# EasyEDA Pro project sensor_design.eprj

# Schematic Schematic1
Board Name: Board1; Create Date: 2025-11-29; Page Name: 1; Project Name: sensor_design; Schematic Name: Schematic1; Update Date: 2025-12-01; Company: 嘉立创EDA; Page Size: A4; Version: V1.0
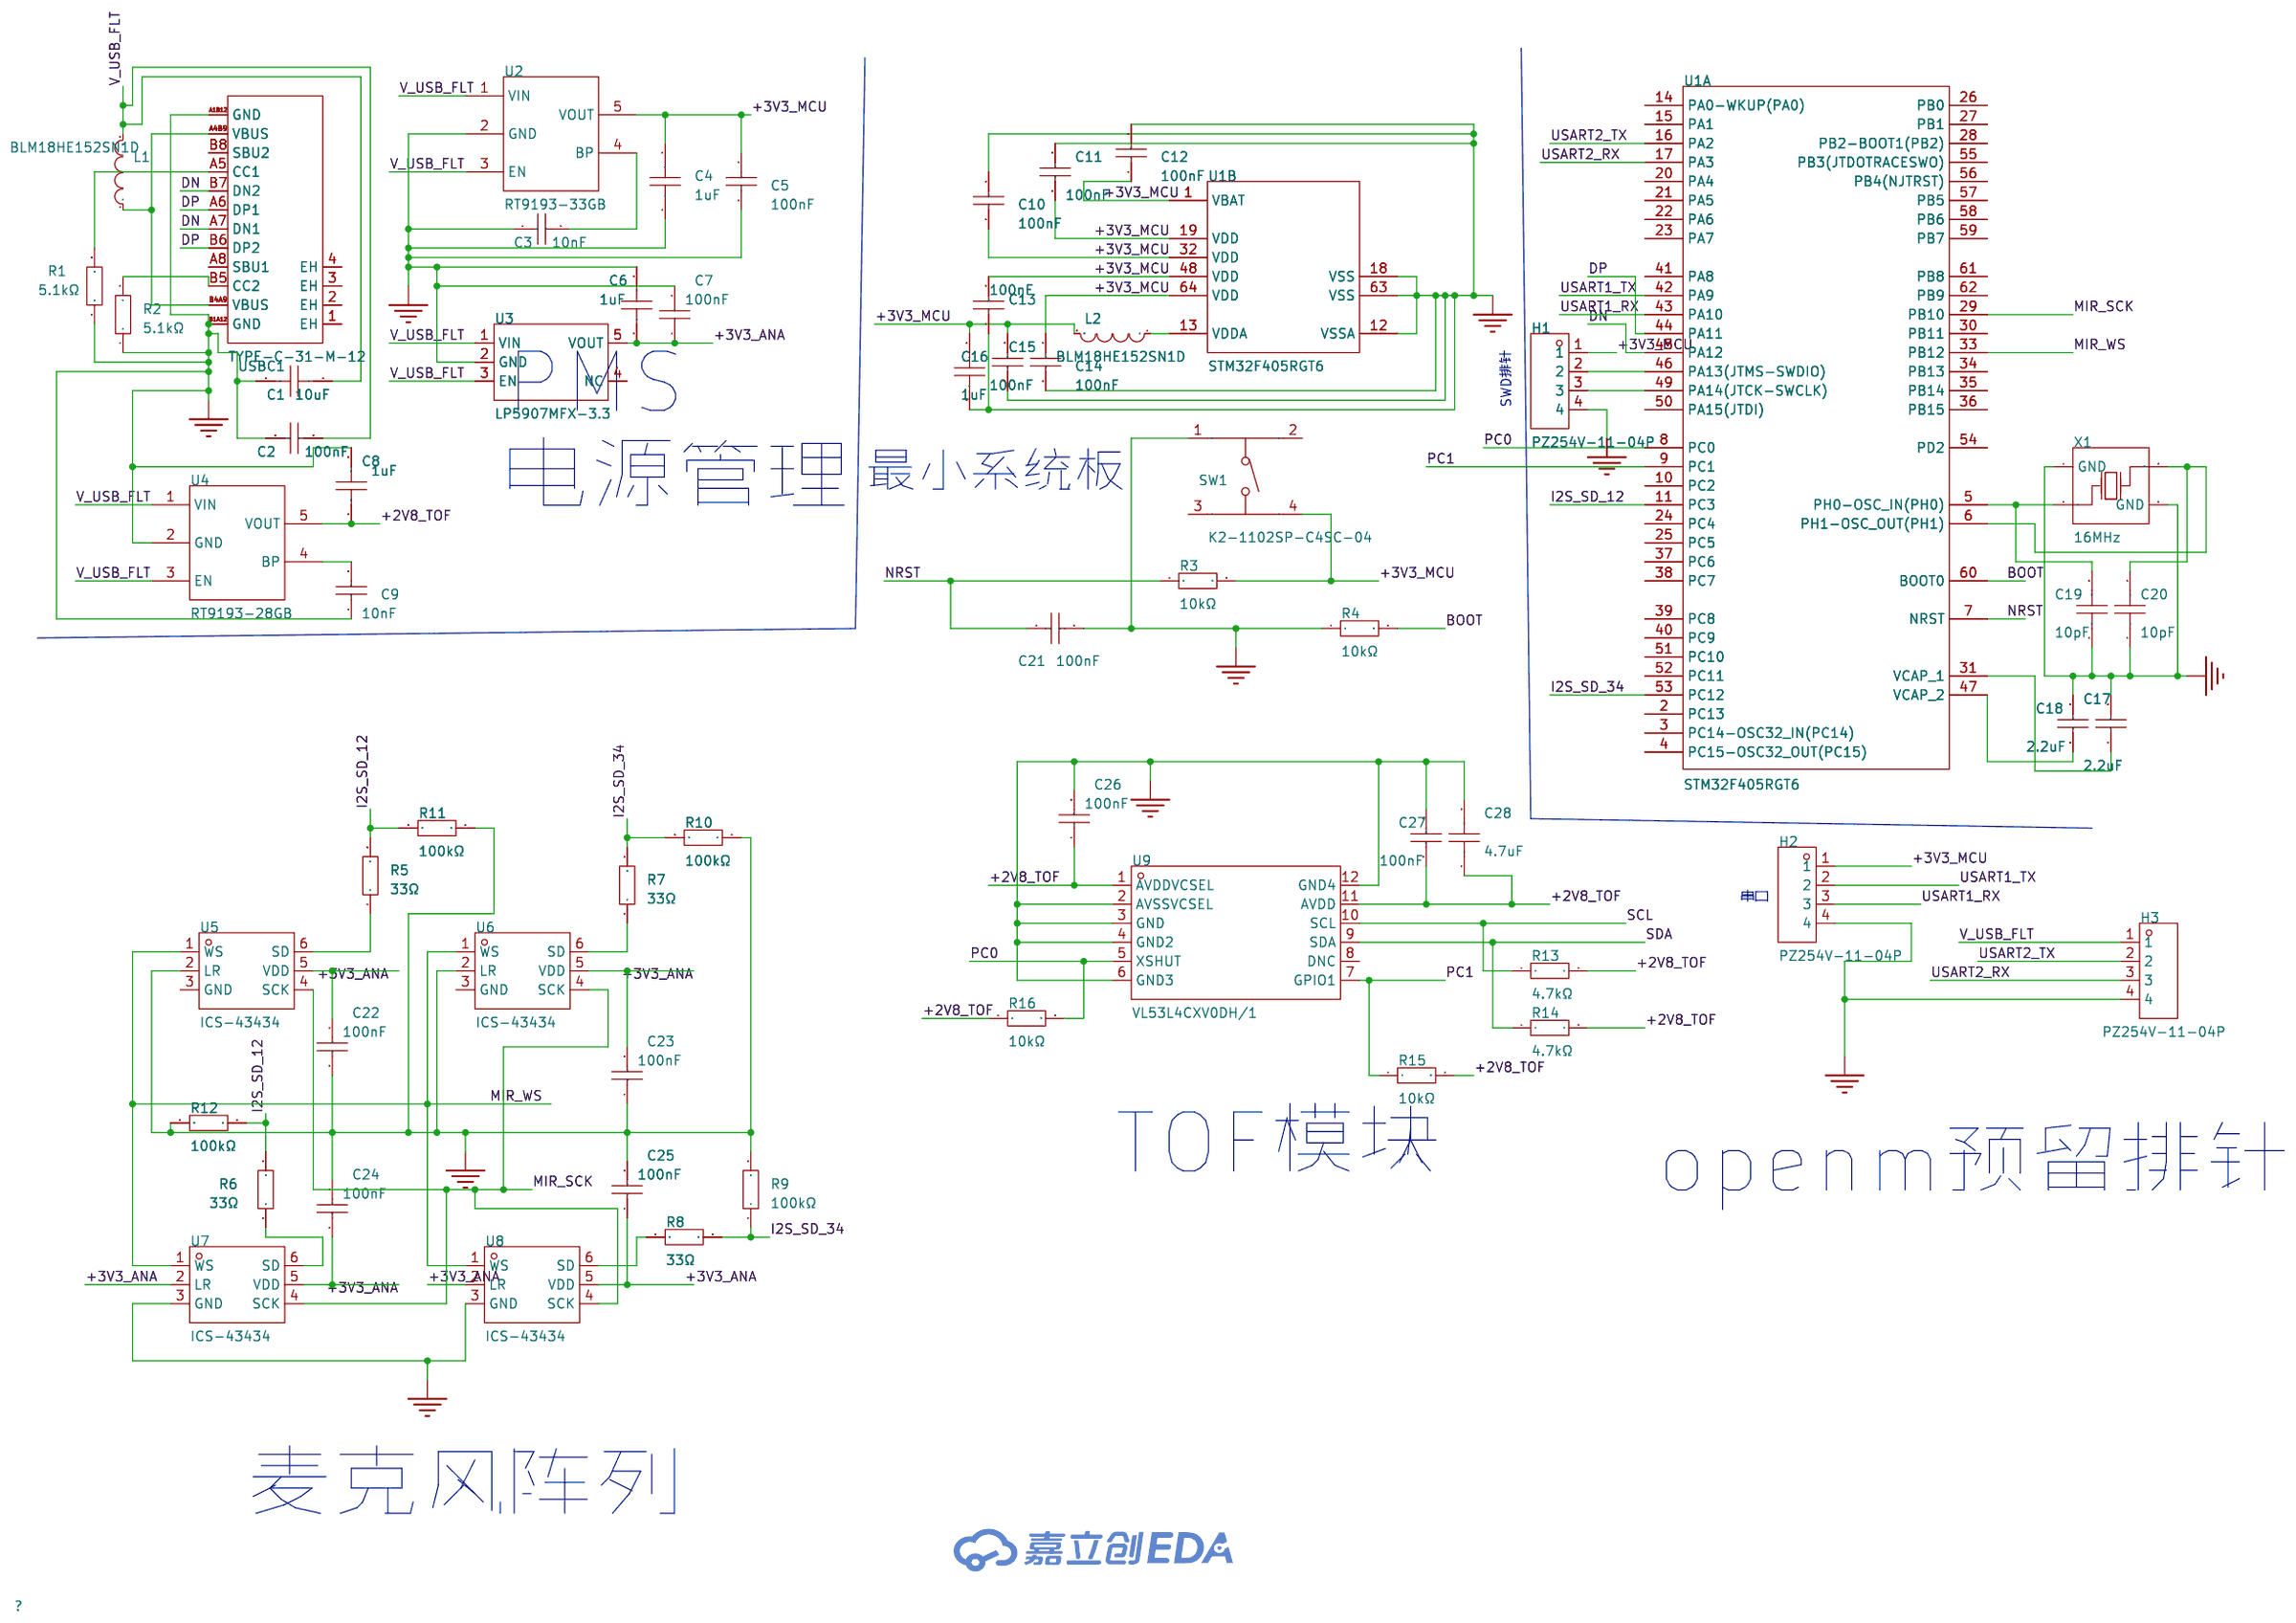
[diagram p0: schematic sheet]

## Parts
C1  10uF  [C0805]
C2  100nF  [C0603]
C3  10nF  [C0603]
C4  1uF  [C0603]
C5  100nF  [C0603]
C6  1uF  [C0603]
C7  100nF  [C0603]
C8  1uF  [C0603]
C9  10nF  [C0603]
C10  100nF  [C0603]
C11  100nF  [C0603]
C12  100nF  [C0603]
C13  100nF  [C0603]
C14  100nF  [C0603]
C15  100nF  [C0603]
C16  1uF  [C0603]
C17  2.2uF  [C0603]
C18  2.2uF  [C0603]
C19  10pF  [C0402]
C20  10pF  [C0402]
C21  100nF  [C0603]
C22  100nF  [C0603]
C23  100nF  [C0603]
C24  100nF  [C0603]
C25  100nF  [C0603]
C26  100nF  [C0402]
C27  100nF  [C0402]
C28  4.7uF  [C0603]
H1  PZ254V-11-04P  [HDR-TH_4P-P2.54-V-M]
H2  PZ254V-11-04P  [HDR-TH_4P-P2.54-V-M]
H3  PZ254V-11-04P  [HDR-TH_4P-P2.54-V-M]
L1  BLM18HE152SN1D  [L0603]
L2  BLM18HE152SN1D  [L0603]
R1  5.1kΩ  [R0603]
R2  5.1kΩ  [R0603]
R3  10kΩ  [R0603]
R4  10kΩ  [R0603]
R5  33Ω  [R0603]
R6  33Ω  [R0603]
R7  33Ω  [R0603]
R8  33Ω  [R0603]
R9  100kΩ  [R0603]
R10  100kΩ  [R0603]
R11  100kΩ  [R0603]
R12  100kΩ  [R0603]
R13  4.7kΩ  [R0603]
R14  4.7kΩ  [R0603]
R15  10kΩ  [R0603]
R16  10kΩ  [R0603]
SW1  K2-1102SP-C4SC-04  [KEY-SMD_4P-L6.0-W6.0-P4.50-LS9.5-BL]
U1  STM32F405RGT6  [LQFP-64_L10.0-W10.0-P0.50-LS12.0-BL]  (sections 1,2)
U2  RT9193-33GB  [SOT-23-5_L3.0-W1.7-P0.95-LS2.8-BL]
U3  LP5907MFX-3.3  [SOT-23-5_L3.0-W1.7-P0.95-LS2.8-BR]
U4  RT9193-28GB  [SOT-23-5_L3.0-W1.7-P0.95-LS2.8-BR]
U5  ICS-43434  [MIC-SMD_6P-L3.5-W2.7-P0.90-BL]
U6  ICS-43434  [MIC-SMD_6P-L3.5-W2.7-P0.90-BL]
U7  ICS-43434  [MIC-SMD_6P-L3.5-W2.7-P0.90-BL]
U8  ICS-43434  [MIC-SMD_6P-L3.5-W2.7-P0.90-BL]
U9  VL53L4CXV0DH/1  [OPTO-SMD_VL53L1CXV0FY-1]
USBC1  TYPE-C-31-M-12  [USB-C_SMD-TYPE-C-31-M-12_1]
X1  16MHz  [CRYSTAL-SMD_4P-L3.2-W2.5-BL]

## Library data of the parts
C1 = GRM21BR61C106KE15L: LCSC Part Name: 10uF ±10% 16V; Supplier Part: C77075; Manufacturer: muRata(村田); Supplier Footprint: 0805; JLCPCB Part Class: 扩展库; Datasheet: https://atta.szlcsc.com/upload/public/pdf/source/20200305/C490387_23319AE8C154DEB24C505E6C82A8106A.pdf; Supplier: LCSC; Tolerance: ±10%; Voltage Rated: 16V; Temperature Coefficient: X5R
C2 C3 C5 C7 C9-C15 C21-C25 = CL10B104KA8NNNC: LCSC Part Name: 100nF ±10% 25V; Supplier Part: C1590; Manufacturer: SAMSUNG(三星); Supplier Footprint: 0603; JLCPCB Part Class: 扩展库; Datasheet: https://item.szlcsc.com/datasheet/CL10B104KA8NNNC/1942.html; Supplier: LCSC; Tolerance: ±10%; Voltage Rating: 25V; Temperature Coefficient: X7R
C4 C6 C8 C16 = GRM188R71C105KE15D: LCSC Part Name: 1uF ±10% 16V; Supplier Part: C77049; Manufacturer: muRata(村田); Supplier Footprint: 0603; JLCPCB Part Class: 扩展库; Datasheet: https://item.szlcsc.com/datasheet/GRM188R71C105KE15D/78176.html; Supplier: LCSC; Tolerance: ±10%; Voltage Rating: 16V; Temperature Coefficient: X7R
C17 C18 = CL10A225KP8NNNC: LCSC Part Name: 2.2uF ±10% 10V; Supplier Part: C1607; Manufacturer: SAMSUNG(三星); Supplier Footprint: 0603; JLCPCB Part Class: 扩展库; Datasheet: https://item.szlcsc.com/datasheet/CL10A225KP8NNNC/1959.html; Supplier: LCSC; Tolerance: ±10%; Voltage Rating: 10V; Temperature Coefficient: X5R
C19 C20 = GJM1555C1H100FB01D: LCSC Part Name: 10pF ±1% 50V; Supplier Part: C782046; Manufacturer: muRata(村田); Supplier Footprint: 0402; JLCPCB Part Class: 扩展库; Datasheet: https://item.szlcsc.com/datasheet/GJM1555C1H100FB01D/835268.html; Supplier: LCSC; Tolerance: ±1%; Voltage Rating: 50V; Temperature Coefficient: C0G
C26 C27 = CGA0402X7R104K250GT: LCSC Part Name: 100nF ±10% 25V; Supplier Part: C6119778; Manufacturer: HRE(芯声); Supplier Footprint: 0402; JLCPCB Part Class: Extended Part; Supplier: LCSC; Tolerance: ±10%; Voltage Rating: 25V; Temperature Coefficient: X7R
C28 = GRM188Z71C475KE21D: LCSC Part Name: 4.7uF ±10% 16V; Supplier Part: C389010; Manufacturer: muRata(村田); Supplier Footprint: 0603; JLCPCB Part Class: 扩展库; Datasheet: https://item.szlcsc.com/datasheet/GRM188Z71C475KE21D/364359.html; Supplier: LCSC; Tolerance: ±10%; Voltage Rating: 16V; Temperature Coefficient: X7R
H1-H3 = PZ254V-11-04P: LCSC Part Name: 1x4P 间距:2.54mm 方针 直插; Supplier Part: C2691448; Manufacturer: XFCN(兴飞); Supplier Footprint: 插件,P=2.54mm; JLCPCB Part Class: 扩展库; Datasheet: https://item.szlcsc.com/datasheet/PZ254V-11-04P/2801085.html; Supplier: LCSC; Pin Structure: 1x4P; Pitch: 2.54mm; Circluar Pins/Square Pins: 方针; Mounting Type: 直插; Number of Rows: 单排; Number of Pins: 4P; Current Rating: 3A; Voltage Rating (Max): 250V; Length of Mating Pin: 6mm; Insulation Height: 2.5mm; Length of End Connection Pin: 3mm; Operating Temperature: -40℃~+105℃; Color: 黑色
L1 L2 = BLM18HE152SN1D: LCSC Part Name: 单路 0603磁珠 阻抗1.5kΩ@100MHz; Supplier Part: C82155; Manufacturer: muRata(村田); Supplier Footprint: 0603; JLCPCB Part Class: 扩展库; Datasheet: https://atta.szlcsc.com/upload/public/pdf/source/20180329/C160980_339BDE1A18CC45CD27BB79F5FF60448B.pdf; Supplier: LCSC; Impedance @ Frequency: 1.5kΩ@100MHz; Tolerance: ±25%; DC Resistance: 500mΩ; Current Rating: 750mA; Circuits: 1
R1 R2 = RC0603FR-075K1L: LCSC Part Name: 厚膜电阻 5.1kΩ ±1% 100mW; Supplier Part: C105580; Manufacturer: YAGEO(国巨); Supplier Footprint: 0603; JLCPCB Part Class: 扩展库; Datasheet: https://item.szlcsc.com/datasheet/RC0603FR-075K1L/106795.html; Supplier: LCSC; Type: 厚膜电阻; Tolerance: ±1%; Power(Watts): 100mW; Voltage-Supply(Max): 75V; Temperature Coefficient: ±100ppm/℃; Operating Temperature: -55℃~+155℃
R3 R4 R15 R16 = 0603WAF1002T5E: LCSC Part Name: 厚膜电阻 10kΩ ±1% 100mW; Supplier Part: C25804; Manufacturer: UNI-ROYAL(厚声); Supplier Footprint: 0603; JLCPCB Part Class: 基础库; Datasheet: https://item.szlcsc.com/datasheet/0603WAF1002T5E/26547.html; Supplier: LCSC; Type: 厚膜电阻; Tolerance: ±1%; Power(Watts): 100mW; Voltage-Supply(Max): 75V; Temperature Coefficient: ±100ppm/℃; Operating Temperature: -55℃~+155℃
R5-R8 = 0603WAF330JT5E: LCSC Part Name: 33Ω ±1% 100mW 厚膜电阻; Supplier Part: C23140; Manufacturer: UNI-ROYAL(厚声); Supplier Footprint: 0603; JLCPCB Part Class: Basic Part; Datasheet: https://item.szlcsc.com/datasheet/0603WAF330JT5E/23867.html; Supplier: LCSC; Type: 厚膜电阻; Tolerance: ±1%; Power(Watts): 100mW; Voltage-Supply(Max): 75V; Temperature Coefficient: ±100ppm/℃; Operating Temperature: -55℃~+155℃
R9-R12 = 0603WAF1003T5E: LCSC Part Name: 100kΩ ±1% 100mW 厚膜电阻; Supplier Part: C25803; Manufacturer: UNI-ROYAL(厚声); Supplier Footprint: 0603; JLCPCB Part Class: 基础库; Datasheet: https://item.szlcsc.com/datasheet/0603WAF1003T5E/26546.html; Supplier: LCSC; Type: 厚膜电阻; Tolerance: ±1%; Power(Watts): 100mW; Voltage-Supply(Max): 75V; Temperature Coefficient: ±100ppm/℃; Operating Temperature: -55℃~+155℃
R13 R14 = 0603WAF4701T5E: LCSC Part Name: 4.7kΩ ±1% 100mW 厚膜电阻; Supplier Part: C23162; Manufacturer: UNI-ROYAL(厚声); Supplier Footprint: 0603; JLCPCB Part Class: 基础库; Datasheet: https://item.szlcsc.com/datasheet/0603WAF4701T5E/23889.html; Supplier: LCSC; Type: 厚膜电阻; Tolerance: ±1%; Power(Watts): 100mW; Voltage-Supply(Max): 75V; Temperature Coefficient: ±100ppm/℃; Operating Temperature: -55℃~+155℃
SW1 = K2-1102SP-C4SC-04: LCSC Part Name: K2-1102SP-C4SC-04 贴片; Supplier Part: C127509; Manufacturer: 韩国韩荣; Supplier Footprint: SMD-4P,6x6mm; JLCPCB Part Class: 扩展库; Datasheet: https://item.szlcsc.com/datasheet/K2-1102SP-C4SC-04/138792.html; Supplier: LCSC; Circuit: 单刀单掷; Actuator Style: 圆形按钮; Operating Force: 2.5N; Mounting Type: 立贴; Length: 6mm; Width: 6mm; Switch Height: 5mm; Contact Current: 50mA; Voltage Rating: 12V; Life: 10万次; Operating Temperature: -25℃~+85℃
U1 = STM32F405RGT6: LCSC Part Name: 带DSP和FPU的高性能基础系列ARM Cortex-M4 MCU，具有1 MB Flash、168 MHz CPU和ART加速器; Supplier Part: C15742; Manufacturer: ST(意法半导体); Supplier Footprint: LQFP-64(10x10); JLCPCB Part Class: 扩展库; Datasheet: https://item.szlcsc.com/datasheet/STM32F405RGT6/16424.html; Supplier: LCSC; CPU Core: ARM-M4; CPU Maximum Speed: 168MHz; Program Storage Size: 1MB; Program Memory Type: FLASH; Number of I/O: 51; ADC (Bit): 12bit; DAC (Bit): 12bit; Voltage - Supply: 1.8V~3.6V
U2 = RT9193-33GB: LCSC Part Name: 输入5.5V 输出3.3V 300mA; Supplier Part: C15651; Manufacturer: RICHTEK(立锜); Supplier Footprint: SOT-23-5; JLCPCB Part Class: 扩展库; Datasheet: https://item.szlcsc.com/datasheet/RT9193-33GB/16332.html; Supplier: LCSC; Output Type: 固定; Voltage - Supply: 5.5V; Output Voltage: 3.3V; Output Current: 300mA; Power Supply Rejection Ratio (PSRR): -50dB@(10kHz); Voltage Dropout: 220mV@(300mA); standby current: 90uA; Noise: 100uVrms; Features: 过流保护；带使能；过热保护; Operating Temperature: -40℃~+125℃@(Tj); Output Configuration: 正极; Number of Outputs: 1
U3 = LP5907MFX-3.3: LCSC Part Name: 集成电路; Supplier Part: C23380874; Manufacturer: TECH PUBLIC(台舟); Supplier Footprint: SOT-23-5; JLCPCB Part Class: 扩展库; Datasheet: https://item.szlcsc.com/datasheet/LP5907MFX-3.3/25111544.html; Supplier: LCSC; Output Type: 固定; Voltage - Supply: 5.5V; Output Voltage: 3.3V; Output Current: 300mA; Power Supply Rejection Ratio (PSRR): 75dB@(1kHz); Voltage Dropout: 180mV@(300mA); standby current: 2uA; Features: 过流保护；带使能；过热保护; Operating Temperature: -40℃~+150℃; Output Configuration: 正极; Number of Outputs: 1
U4 = RT9193-28GB: LCSC Part Name: 输入5.5V 输出2.8V 300mA; Supplier Part: C56731; Manufacturer: RICHTEK(立锜); Supplier Footprint: SOT-23-5; JLCPCB Part Class: 扩展库; Datasheet: https://item.szlcsc.com/datasheet/RT9193-28GB/57761.html; Supplier: LCSC; Output Type: 固定; Voltage - Supply: 5.5V; Output Voltage: 2.8V; Output Current: 300mA; Power Supply Rejection Ratio (PSRR): 50dB@(10kHz); Voltage Dropout: 300mV@(300mA); standby current: 130uA; Noise: 100uVrms; Features: 过流保护；热关断; Operating Temperature: -40℃~+85℃@(Ta); Output Configuration: 正极; Number of Outputs: 1
U5-U8 = ICS-43434_C5656610: Supplier Part: C5656610; Manufacturer: TDK InvenSense(应美盛); JLCPCB Part Class: 扩展库; Datasheet: https://item.szlcsc.com/datasheet/ICS-43434/6577565.html; Supplier: LCSC; Direction: 全指向; Voltage - Supply: 1.65V~3.63V; Current Consumption: 550uA; S/N Ratio: 64dB
U9 = VL53L4CXV0DH/1: LCSC Part Name: I2C接口的具有扩展范围测量的飞行时间传感器; Supplier Part: C3178292; Manufacturer: ST(意法半导体); Supplier Footprint: SMD-12P,4.4x2.4mm; JLCPCB Part Class: 扩展库; Datasheet: https://item.szlcsc.com/datasheet/VL53L4CXV0DH%252F1/3740230.html; Supplier: LCSC; Voltage - Supply: 2.6V~3.5V; Linear Range: 0m~6m; Current - Supply: 21mA
USBC1 = TYPE-C-31-M-12: LCSC Part Name: Type-C 母; Supplier Part: C165948; Manufacturer: 韩国韩荣; Supplier Footprint: SMD; JLCPCB Part Class: 扩展库; Datasheet: https://item.szlcsc.com/datasheet/TYPE-C-31-M-12/177331.html; Supplier: LCSC; Connector Type: Type-C; Gender: 母; Number of Contacts: 16P; Number of Ports: 1; Current Rating-Power: 5A
X1 = TSX-3225 16.0000MF18X-AC3: LCSC Part Name: 16MHz ±10ppm 9pF; Supplier Part: C1986974; Manufacturer: EPSON(爱普生); Supplier Footprint: SMD3225-4P; JLCPCB Part Class: 扩展库; Datasheet: https://item.szlcsc.com/datasheet/TSX-3225%252016.0000MF18X-AC3/2078519.html; Supplier: LCSC; Normal temperature Frequency Tolerance: ±10ppm; Load Capacitance: 9pF; Frequency Stability: ±18ppm; Equivalent Series Resistance(ESR): 60Ω; Operating Temperature: -40℃~+85℃

## Nets
+2V8_TOF: C8.1 C26.1 C27.1 C28.1 R13.2 R14.2 R15.2 R16.1 U4.5(VOUT) U9.1(AVDDVCSEL) U9.11(AVDD)
+3V3_ANA: C6.1 C7.1 C22.2 C23.2 C24.1 C25.1 U3.5(VOUT) U5.5(VDD) U6.5(VDD) U7.2(LR) U7.5(VDD) U8.2(LR) U8.5(VDD)
+3V3_MCU: C4.2 C5.2 C10.1 C11.1 C12.1 C13.2 C14.2 C15.2 C16.2 H1.1 H2.1 L2.2 R3.2 SW1.4 U1.1(VBAT) U1.19(VDD) U1.32(VDD) U1.48(VDD) U1.64(VDD) U2.5(VOUT)
GND: C1.1 C2.1 C3.1 C4.1 C5.1 C6.2 C7.2 C8.2 C9.1 C10.2 C11.2 C12.2 C13.1 C14.1 C15.1 C16.1 C17.2 C18.2 C19.1 C20.1 C21.1 C22.1 C23.1 C24.2 C25.2 C26.2 C27.2 C28.2 H1.4 H2.4 H3.4 R1.1 R2.1 R4.1 R9.2 R10.1 R11.1 R12.2 SW1.1 U1.12(VSSA) U1.18(VSS) U1.63(VSS) U2.2(GND) U3.2(GND) U4.2(GND) U5.2(LR) U6.2(LR) U7.3(GND) U8.3(GND) U9.2(AVSSVCSEL) U9.3(GND) U9.4(GND2) U9.6(GND3) U9.12(GND4) USBC1.A1B12(GND) USBC1.B1A12(GND) X1.2(GND) X1.4(GND)
BOOT: R4.2 U1.60(BOOT0)
DN: U1.45(PA12) USBC1.A7(DN1) USBC1.B7(DN2)
DP: U1.44(PA11) USBC1.A6(DP1) USBC1.B6(DP2)
I2S_SD_12: R5.2 R6.2 R11.2 R12.1 U1.11(PC3)
I2S_SD_34: R7.2 R8.1 R9.1 R10.2 U1.53(PC12)
MIR_SCK: U1.29(PB10) U5.4(SCK) U6.4(SCK) U7.4(SCK) U8.4(SCK)
MIR_WS: U1.33(PB12) U5.1(WS) U6.1(WS) U7.1(WS) U8.1(WS)
NRST: C21.2 R3.1 U1.7(NRST)
PC0: R16.2 U1.8(PC0) U9.5(XSHUT)
PC1: R15.1 U1.9(PC1) U9.7(GPIO1)
SCL: R13.1 U9.10(SCL)
SDA: R14.1 U9.9(SDA)
USART1_RX: H2.3 U1.43(PA10)
USART1_TX: H2.2 U1.42(PA9)
USART2_RX: H3.3 U1.17(PA3)
USART2_TX: H3.2 U1.16(PA2)
V_USB_FLT: C1.2 C2.2 H3.1 L1.2 U2.1(VIN) U2.3(EN) U3.1(VIN) U3.3(EN) U4.1(VIN) U4.3(EN)
Net-(C3-2): C3.2 U2.4(BP)
Net-(C9-2): C9.2 U4.4(BP)
Net-(C17-1): C17.1 U1.31(VCAP_1)
Net-(C18-1): C18.1 U1.47(VCAP_2)
Net-(C19-2): C19.2 U1.5(PH0-OSC_IN(PH0)) X1.1(OSC1)
Net-(C20-2): C20.2 U1.6(PH1-OSC_OUT(PH1)) X1.3(OSC2)
Net-(H1-2): H1.2 U1.46(PA13(JTMS-SWDIO))
Net-(H1-3): H1.3 U1.49(PA14(JTCK-SWCLK))
Net-(L1-1): L1.1 USBC1.A4B9(VBUS) USBC1.B4A9(VBUS)
Net-(L2-1): L2.1 U1.13(VDDA)
Net-(R1-2): R1.2 USBC1.A5(CC1)
Net-(R2-2): R2.2 USBC1.B5(CC2)
Net-(R5-1): R5.1 U5.6(SD)
Net-(R6-1): R6.1 U7.6(SD)
Net-(R7-1): R7.1 U6.6(SD)
Net-(R8-2): R8.2 U8.6(SD)

Not connected (* = marked no-connect by the designer): SW1 2 3; U1 2(PC13) 3(PC14-OSC32_IN(PC14)) 4(PC15-OSC32_OUT(PC15)) 10(PC2) 14(PA0-WKUP(PA0)) 15(PA1) 20(PA4) 21(PA5) 22(PA6) 23(PA7) 24(PC4) 25(PC5) 26(PB0) 27(PB1) 28(PB2-BOOT1(PB2)) 30(PB11) 34(PB13) 35(PB14) 36(PB15) 37(PC6) 38(PC7) 39(PC8) 40(PC9) 41(PA8) 50(PA15(JTDI)) 51(PC10) 52(PC11) 54(PD2) 55(PB3(JTDOTRACESWO)) 56(PB4(NJTRST)) 57(PB5) 58(PB6) 59(PB7) 61(PB8) 62(PB9); U3 4(NC); U5 3(GND); U6 3(GND); U9 8(DNC); USBC1 1(EH) 2(EH) 3(EH) 4(EH) A8(SBU1) B8(SBU2)

## Notes on the sheet
- SWD排针
- PMS
  电源管理
- 最小系统板
- 串口
- TOF模块
- openm预留排针
- 麦克风阵列
